# Altium schematic sheet E21-015 PS Update.SchDoc: PS Update
size B; DrawnBy: R. Lam, D. Muhlert, V. Soutyrine; Engineer: P. Trochtchanovitch; Organization: University of British Columbia; Address1: Physics & Astronomy Department; Address2: Electronics Lab - Room 254; Address3: 6224 Agricultural Road; Address4: Vancouver BC V6T 1Z1 Canada; DocumentNumber: E21-015; Revision: 1; SheetNumber: 1; SheetTotal: 1
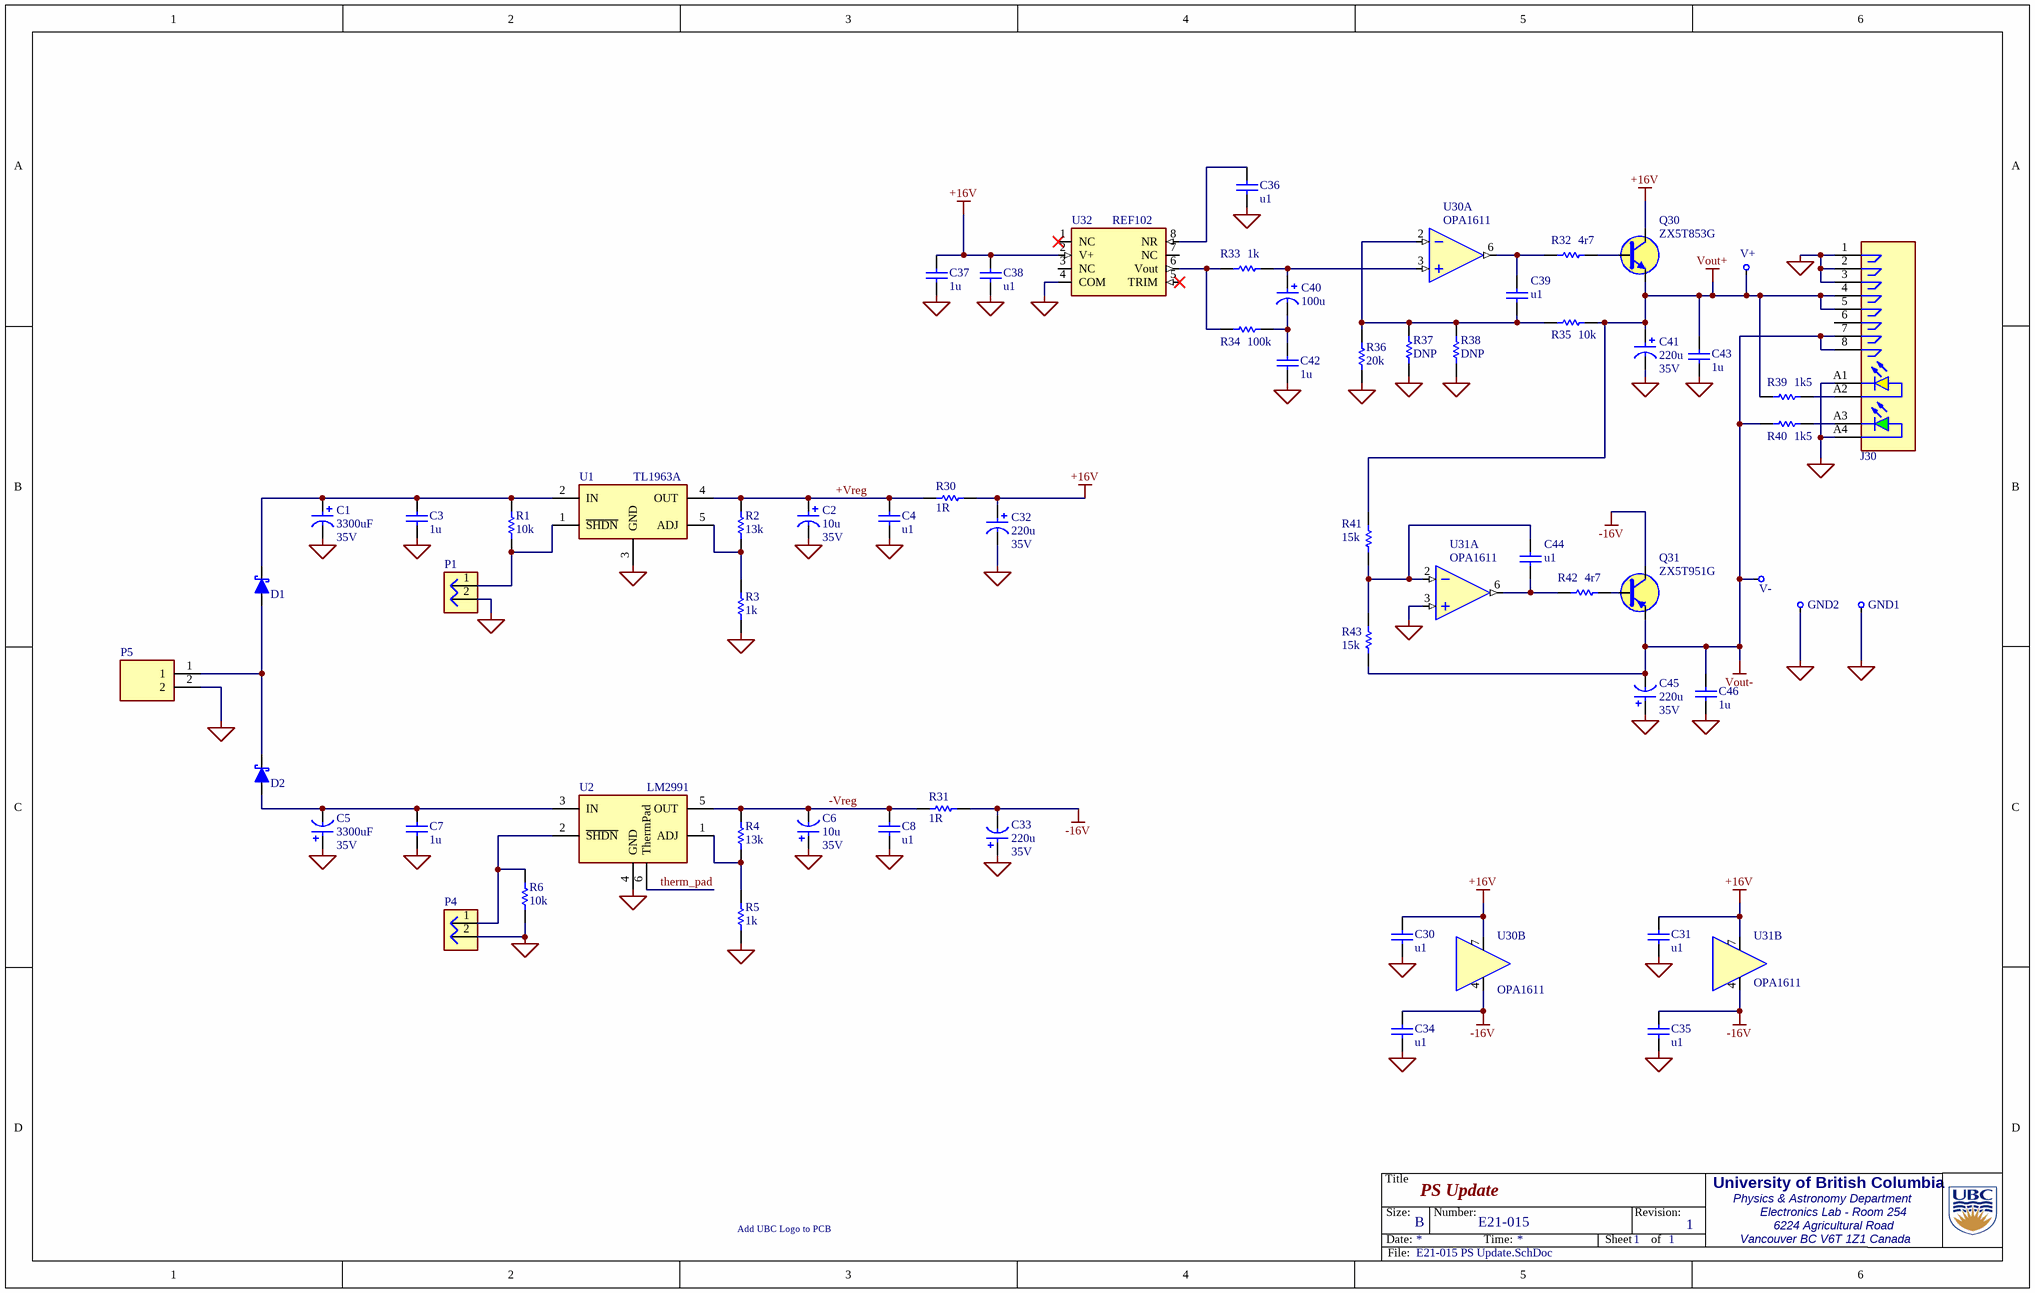
[diagram p0: E21-015 PS Update.SchDoc]

## Parts
?  (no value)
C1  value 3300uF  Voltage: 35V  [C-RAD7.5mm-18mm]  (hidden comment: Cap Elec 3300u 35V LESR)
C2  value 10u  Voltage: 35V  [CC7343]  (hidden comment: Cap Tant 10uF 35V D-Size)
C3  value 1u  [C2012-0805]  (hidden comment: Cap Misc)
C4  value u1  [C2012-0805]  (hidden comment: Cap Misc)
C5  value 3300uF  Voltage: 35V  [C-RAD7.5mm-18mm]  (hidden comment: Cap Elec 3300u 35V LESR)
C6  value 10u  Voltage: 35V  [CC7343]  (hidden comment: Cap Tant 10uF 35V D-Size)
C7  value 1u  [C2012-0805]  (hidden comment: Cap Misc)
C8  value u1  [C2012-0805]  (hidden comment: Cap Misc)
C30  value u1  [C2012-0805]  (hidden comment: Cap Misc)
C31  value u1  [C2012-0805]  (hidden comment: Cap Misc)
C32  value 220u  Voltage: 35V  [C-RAD400mil]  (hidden comment: Cap Elec 220u 35V)
C33  value 220u  Voltage: 35V  [C-RAD400mil]  (hidden comment: Cap Elec 220u 35V)
C34  value u1  [C2012-0805]  (hidden comment: Cap Misc)
C35  value u1  [C2012-0805]  (hidden comment: Cap Misc)
C36  value u1  [C2012-0805]  (hidden comment: Cap Misc)
C37  value 1u  [C2012-0805]  (hidden comment: Cap Misc)
C38  value u1  [C2012-0805]  (hidden comment: Cap Misc)
C39  value u1  [C2012-0805]  (hidden comment: Cap Misc)
C40  value 100u  [CC7343]  (hidden comment: Cap Tant 100uF 10V)
C41  value 220u  Voltage: 35V  [C-RAD400mil]  (hidden comment: Cap Elec 220u 35V)
C42  value 1u  [C2012-0805]  (hidden comment: Cap Misc)
C43  value 1u  [C2012-0805]  (hidden comment: Cap Misc)
C44  value u1  [C2012-0805]  (hidden comment: Cap Misc)
C45  value 220u  Voltage: 35V  [C-RAD400mil]  (hidden comment: Cap Elec 220u 35V)
C46  value 1u  [C2012-0805]  (hidden comment: Cap Misc)
D1  1N5819  [DO-214AA]  (value not drawn)
D2  1N5819  [DO-214AA]  (value not drawn)
GND1  Check Point  [PAD-110-52]  (value not drawn)
GND2  Check Point  [PAD-110-52]  (value not drawn)
J30  RJ45_RJE58_Amphenol  [RJ45_RJE51_LEDs]  (value not drawn)
Logo30  Use UBC Logo  [UBC Logo]  (value not drawn)  (no BOM)
P1  HEADER 1X2 L  [HDR1X2_LOCKING]  (value not drawn)
P4  HEADER 1X2 L  [HDR1X2_LOCKING]  (value not drawn)
P5  0039296028  [MOLEX_0039296028]  (value not drawn)
Q30  ZX5T853G  [SOT-223]
Q31  ZX5T951G  [SOT-223]
R1  value 10k  [R0805]  (hidden comment: Res-0805)
R2  value 13k  [R0805]  (hidden comment: Res-0805)
R3  value 1k  [R0805]  (hidden comment: Res-0805)
R4  value 13k  [R0805]  (hidden comment: Res-0805)
R5  value 1k  [R0805]  (hidden comment: Res-0805)
R6  value 10k  [R0805]  (hidden comment: Res-0805)
R30  value 1R  [R2010]  (hidden comment: Res-2010)
R31  value 1R  [R2010]  (hidden comment: Res-2010)
R32  value 4r7  [R0805]  (hidden comment: Res-0805)
R33  value 1k  [R0805]  (hidden comment: Res-0805)
R34  value 100k  [R0805]  (hidden comment: Res-0805)
R35  value 10k  [R0805]  (hidden comment: Res-0805)
R36  value 20k  [R0805]  (hidden comment: Res-0805)
R37  value DNP  [R0805]  (hidden comment: Res-0805)
R38  value DNP  [R0805]  (hidden comment: Res-0805)
R39  value 1k5  [R0805]  (hidden comment: Res-0805)
R40  value 1k5  [R0805]  (hidden comment: Res-0805)
R41  value 15k  [R0805]  (hidden comment: Res-0805)
R42  value 4r7  [R0805]  (hidden comment: Res-0805)
R43  value 15k  [R0805]  (hidden comment: Res-0805)
U1  TL1963A  [TO-263-5]
U2  LM2991  [TO-263-5]
U30  Part Number: OPA1611  [SO-G8]  (hidden comment: LME49990)  (parts A,B of 2)
U31  Part Number: OPA1611  [SO-G8]  (hidden comment: LME49990)  (parts A,B of 2)
U32  REF102  [SO-G8]
V+  Check Point  [PAD-110-52]  (value not drawn)
V-  Check Point  [PAD-110-52]  (value not drawn)

## Nets
+16V: C30.2 C31.2 C32.1 C37.2 C38.2 Q30.2(C) R30.2 U30.7(+Vs) U31.7(+Vs) U32.2(V+)
-16V: C33.2 C34.2 C35.2 Q31.2(C) R31.2 U30.4(-Vs) U31.4(-Vs)
GND: C1.2 C2.2 C3.1 C4.1 C5.1 C6.1 C7.1 C8.1 C30.1 C31.1 C32.2 C33.1 C34.1 C35.1 C36.1 C37.1 C38.1 C41.2 C42.1 C43.1 C45.1 C46.1 GND1.1 GND2.1 J30.1 J30.2 J30.3 J30.A1(K) J30.A4(A) P1.2 P4.2 P5.2 R3.1 R5.1 R6.2 R36.1 R37.1 R38.1 U1.3(GND) U1.6(GND) U2.4(GND) U31.3(IN+) U32.4(COM)
Vout+: C41.1 C43.2 J30.4 J30.5 Q30.3(E) R35.2 R39.2 R41.2 V+.1
Vout-: C45.2 C46.2 J30.7 J30.8 Q31.3(E) R40.2 R43.1 V-.1
+Vreg: C2.1 C4.2 R2.2 R30.1 U1.4(OUT)
-Vreg: C6.2 C8.2 R4.2 R31.1 U2.5(OUT)
therm_pad: U2.6(ThermPad)
NetC1_1: C1.1 C3.2 D1.2(K) R1.2 U1.2(IN)
NetC5_2: C5.2 C7.2 D2.1(A) U2.3(IN)
NetC36_2: C36.2 U32.8(NR)
NetC39_1: C39.1 R35.1 R36.2 R37.2 R38.2 U30.2(IN-)
NetC39_2: C39.2 R32.1 U30.6(OUT)
NetC40_1: C40.1 R33.2 U30.3(IN+)
NetC40_2: C40.2 C42.2 R34.2
NetC44_1: C44.1 R41.1 R43.2 U31.2(IN-)
NetC44_2: C44.2 R42.2 U31.6(OUT)
NetD1_1: D1.1(A) D2.2(K) P5.1
NetJ30_A2: J30.A2(A) R39.1
NetJ30_A3: J30.A3(K) R40.1
NetP1_1: P1.1 R1.1 U1.1(~{SHDN})
NetP4_1: P4.1 R6.1 U2.2(~{SHDN})
NetQ30_1: Q30.1(B) R32.2
NetQ31_1: Q31.1(B) R42.1
NetR2_1: R2.1 R3.2 U1.5(ADJ)
NetR4_1: R4.1 R5.2 U2.1(ADJ)
NetR33_1: R33.1 R34.1 U32.6(Vout)

Not connected (* = marked no-connect by the designer): J30 6; U32 1(NC)* 3(NC) 5(TRIM)* 7(NC)

## Notes on the sheet
- Title
- Size:
- Date:
- B
- Number:
- Time:
- Sheet
- Revision:
- of
- File:
- (in symbol Directive: Add UBC Logo to PCB) Add UBC Logo to PCB

## Library data of the parts
? = UBC Logo
C1 C5 = Cap Elec 1000u 35V LESR: 3300u 35V Low ESR Radial Lead; Manufacturer: Nichicon; Part Number: EKYB350ELL332MM25S; Class: Passive; SubClass: Capacitor; Type: TH; Published: 2003/7/14; Publisher: UBC; Price: $
C2 C6 = Cap Tant 10uF 35V D-Size: Manufacturer: Kemet; Part Number: T491D106035DAT; Class: Passive; SubClass: Capacitor; Type: SMD; Published: 2006-10-30; Publisher: UBC; Price: $0.20
C3 C4 C7 C8 C30 C31 C34-C39 C42-C44 C46 = Cap Misc: Misc Capacitor; Manufacturer: Generic Components; Class: Passive; Type: SMD; Published: 08/06/2000; Publisher: Altium Hobart Technology Centre; SubClass: Capacitor; Price: $
C32 C33 C41 C45 = Cap Elec 220u 35V: 220u 35V Low ESR Radial Lead; Manufacturer: Mallory; Part Number: SK221M025ST; Class: Passive; SubClass: Capacitor; Type: TH; Scuba2 No.: 000645 CAP; Published: 2003/7/14; Publisher: UBC; Price: $1.17
C40 = Cap Tant 100uF 10V: Cap Tant Poly 100uF 10V D-Size Low ESR; Manufacturer: Kemet; Part Number: T520D107M010ASE018; Class: Passive; SubClass: Capacitor; Type: SMD; Scuba2 No.: 000523 CAP; Published: 2003/8/21; Publisher: UBC; Price: $0.05; Voltage: 10V
D1 D2 = 1N5819: Schottky Barrier Diode 40V 1A; Manufacturer: Motorola; Class: Discrete; SubClass: Diode - Switching; Type: TH; Published: 2004/05/27; Publisher: UBC; Part Number: 1N5819
GND1 GND2 V+ V- = Check Point: PCB Check Point; Manufacturer: UBC; Part Number: 20-313143A; Class: Passive; Published: 03/17/2003; Price: $; Type: TH; Publisher: R. Lam
J30 = RJ45_RJE58_Amphenol: RJ45 Socket RA PCB mount CAT6 w/ LED's; Part Number: RJE58; Manufacturer: Amphenol; Price: $; Type: TH; Published: 2015/01/05; Publisher: UBC
Logo30 = Directive: Add UBC Logo to PCB: UBC Logo
P1 P4 = HEADER 1X2 L: 0.1" Spacing 1x2 Locking Header; Manufacturer: AMP; Price: $; Type: TH; Publisher: UBC; Published: 3/25/2003
P5 = 0039296028: Connector Header Through Hole 2 position; MF: Molex; Price: None; SnapEDA_Link: https://www.snapeda.com/parts/0039296028/Molex/view-part/2751623/?ref=snap; Package: None; Availability: Unavailable; MP: 0039296028; Value: *
Q30 = ZX5T853G: 1000V NPN Medium Power Low Sat Transistor; Manufacturer: Diodes Inc.; Class: Discrete; Type: SMT; Published: 2016-01-05; Publisher: UBC; SubClass: Transistor; Price: $; Part Number: ZX5T853G
Q31 = ZX5T951G: 60V PNP Medium Power Low Sat Transistor; Manufacturer: Diodes Inc.; Class: Discrete; Type: SMT; Published: 2016-01-05; Publisher: UBC; SubClass: Transistor; Price: $; Part Number: ZX5T951G
R1-R6 R32-R43 = Res-0805: Resistor; Manufacturer: Generic Components; Class: Passive; Published: 08/06/2000; Publisher: Altium Hobart Technology Centre; SubClass: Resistor; Price: $; Type: SMD
R30 R31 = Res-2010: Resistor; Manufacturer: Generic Components; Class: Passive; Published: 08/06/2000; Publisher: Altium Hobart Technology Centre; SubClass: Resistor; Price: $; Type: SMD
U1 = TL1963A: LDO +V. Regulator ADJ  1.5A; Manufacturer: TI; Price: $1.34; Type: SMD; Part Number: TL1963A
U2 = LM2991: LDO -V. Regulator ADJ  1.5A; Manufacturer: TI; Price: $1.34; Type: SMD; Part Number: LM2991
U30 U31 = LME49990: Ultra low distortion and noise Op Amp; Manufacturer: TI; Class: Amplifier; SubClass: Operational Amplifier; Published: 2015-11-26; Publisher: UBC; Price: $; Type: SMD
U32 = REF102: 10V Precision Voltage Reference; Manufacturer: Texas Instruments; Class: Amplifier; Published: 26/11/2015; Publisher: Altium Hobart Technology Centre; Part Number: REF102; Type: SMD